# Altium project Kasli-SOC.PrjPcb (part 4 of 11)

## Sheet Kasli-SOC_bank13.SchDoc: Bank 13
size 420 x 297 mm; Projet: FPGA & ARM SoC FMC Carrier; CheckedBy: G.Kasprowicz; Author: F.Switakowski; CompanyName: WUT ISE; DrawnBy: F.Switakowski; Organization: WUT ISE; Address1: PW ISE; Address2: Nowowiejska 15/19 00-665 Warsaw; Address3: gkasprow@gmail.com; DocumentNumber: 8; Revision: 1; SheetNumber: 8; SheetTotal: 18; ModifiedBy: -; CheckedDate: -; Title2: misc signals; DivGrp: WUT ISE; Designer: G.Kasprowicz; ModifiedDate: -; ProjectName: Sensor Box
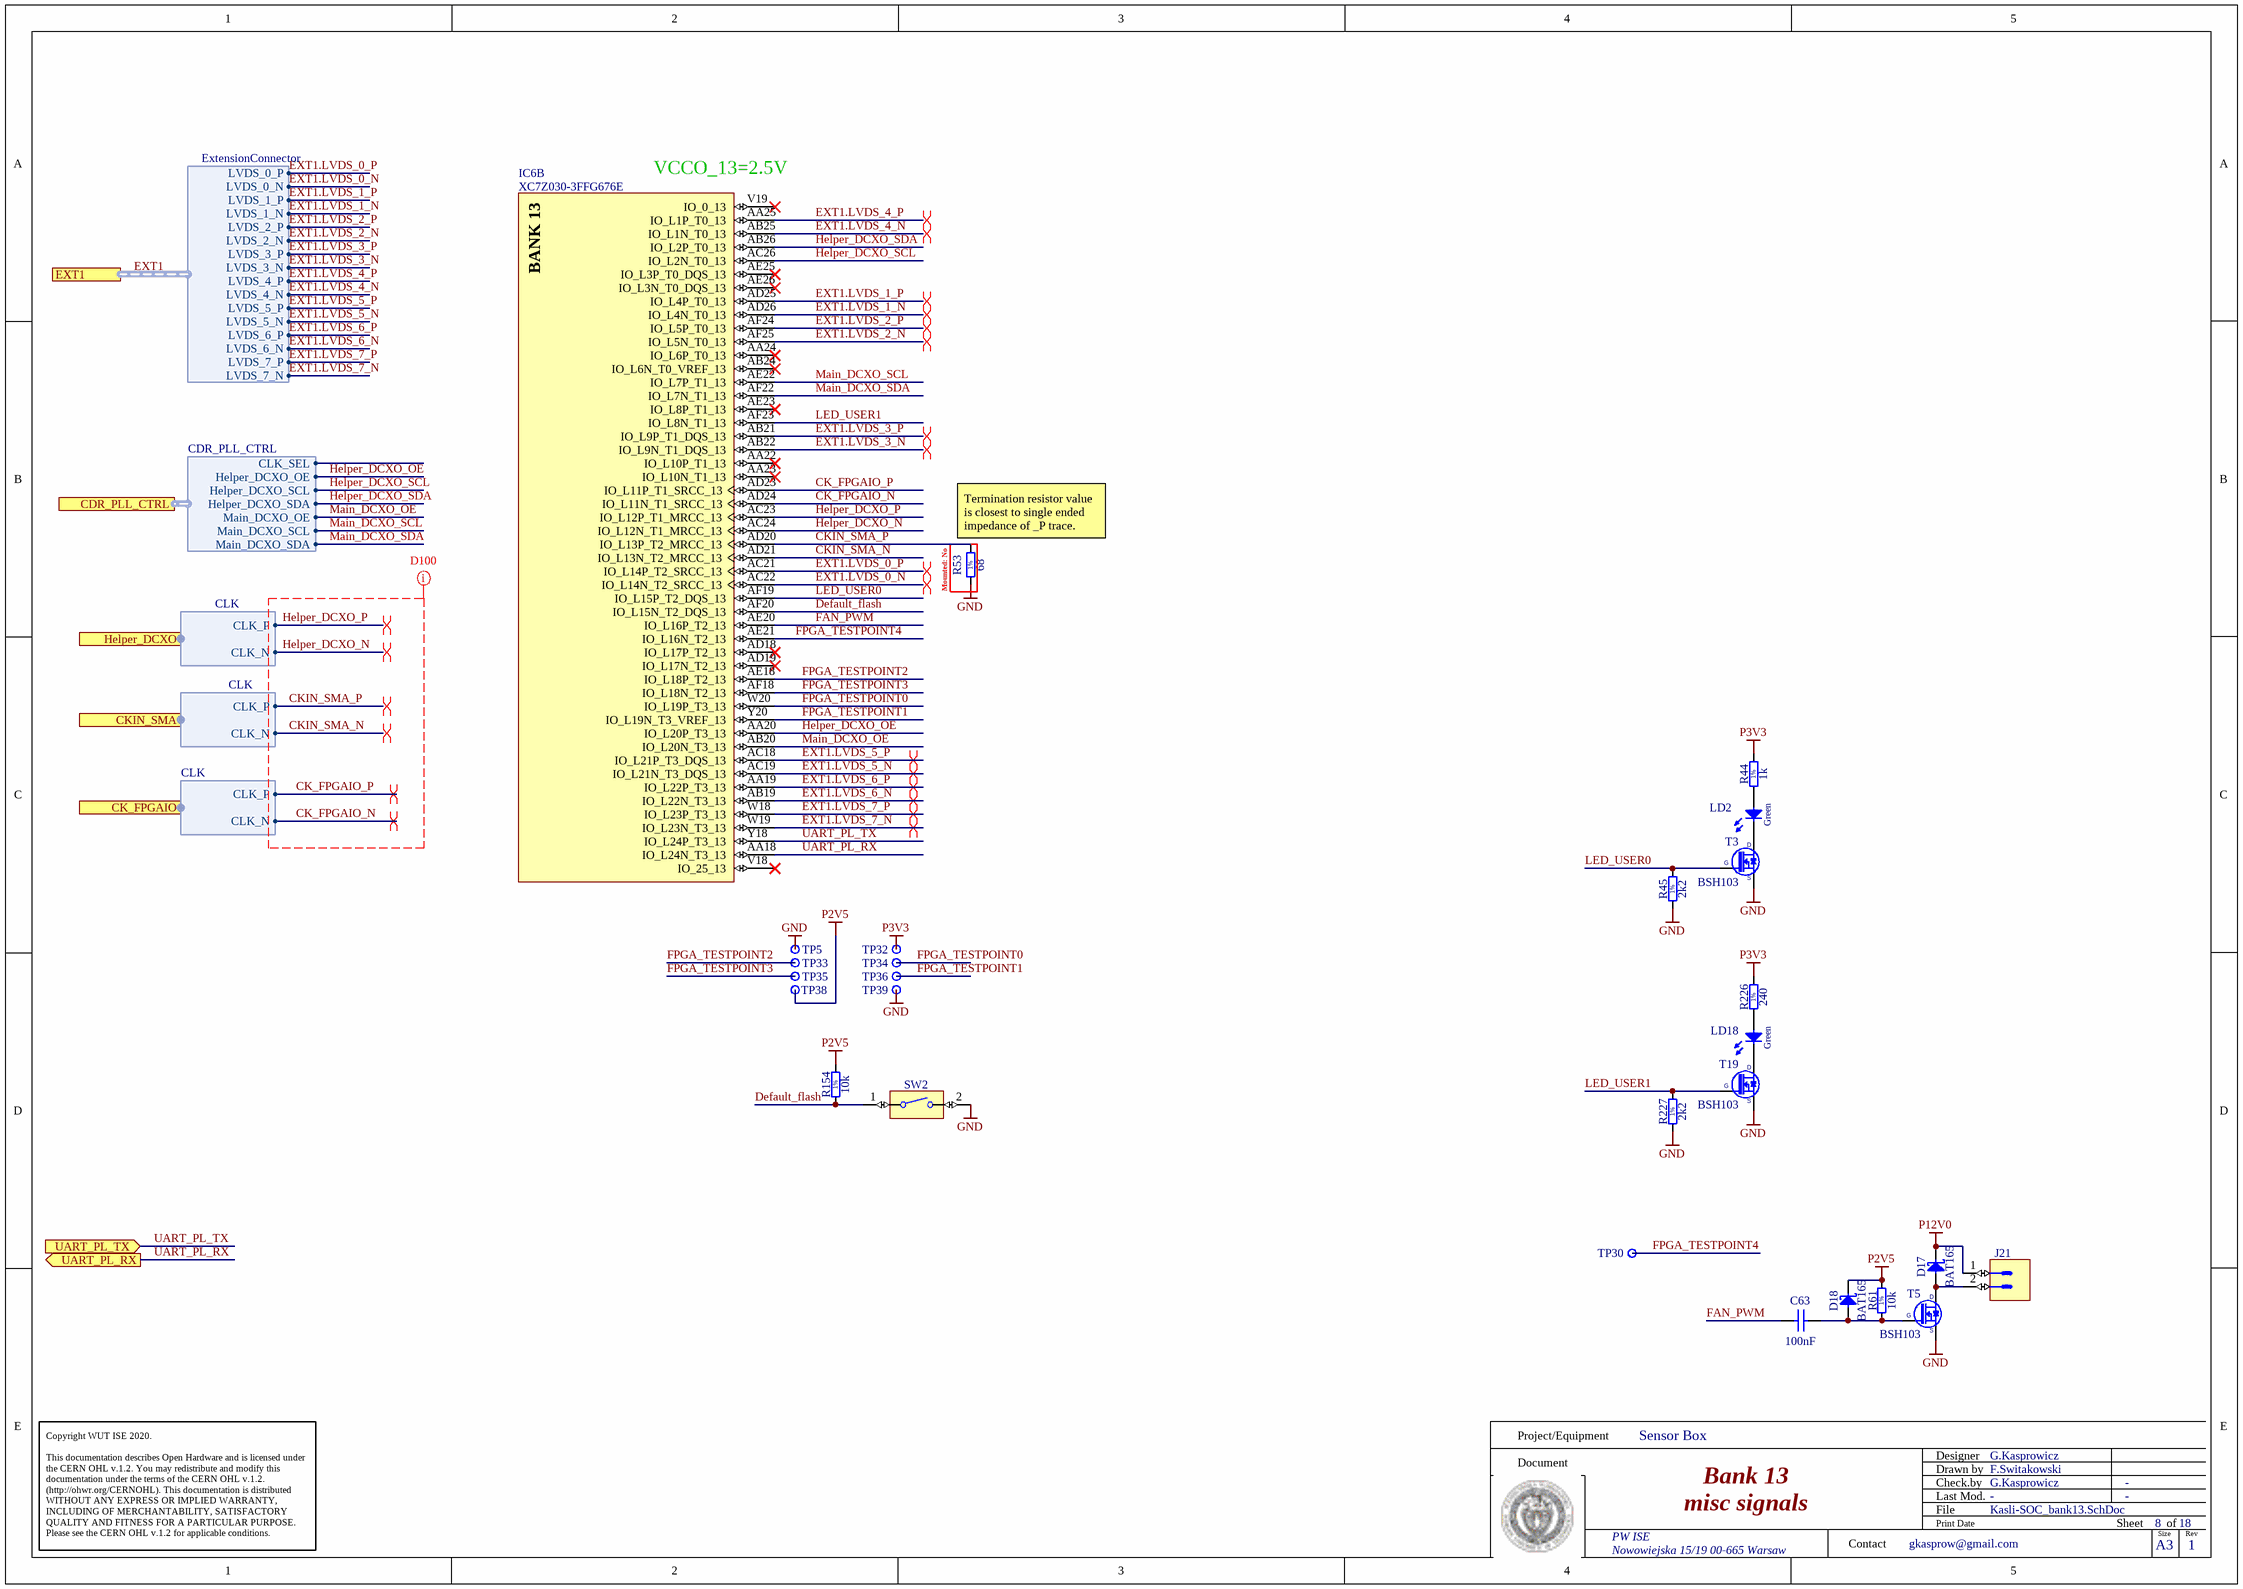
[diagram p7: Kasli-SOC_bank13.SchDoc]

### Parts
C63  100nF  [CAPC0603X33N]
D17  BAT165  [SOD2512X110N]
D18  BAT165  [SOD2512X110N]
IC6  XC7Z030-3FFG676E  [BGA676C100P26X26_2700X2700X324]  (part B of 14)
J21  KK®  [MOLEX_22-27-2021]  (value not drawn)
LD2  Green  [LED_KINGBRIGHT_KPH-1608CGCK]
LD18  Green  [LED_AVAGO_HSME-C120]
R44  1k  [RESC1005X40N]
R45  2k2  [RESC1005X40N]
R53  68  [RESC1005X40N]
R61  10k  [RESC1005X40N]
R154  10k  [RESC1005X40N]
R226  240  [RESC1005X40N]
R227  2k2  [RESC1005X40N]
SW2  Switch  [SW_OMRON_B3U-3000PM]  (value not drawn)
T3  BSH103  [SOT95P230X110-3N]
T5  BSH103  [SOT95P230X110-3N]
T19  BSH103  [SOT95P230X110-3N]
TP5  Plated Hole  [c170h100]  (value not drawn)  (no BOM)
TP30  Test Point  [TPS127]  (value not drawn)  (no BOM)
TP32  Plated Hole  [c170h100]  (value not drawn)  (no BOM)
TP33  Plated Hole  [c170h100]  (value not drawn)  (no BOM)
TP34  Plated Hole  [c170h100]  (value not drawn)  (no BOM)
TP35  Plated Hole  [c170h100]  (value not drawn)  (no BOM)
TP36  Plated Hole  [c170h100]  (value not drawn)  (no BOM)
TP38  Plated Hole  [c170h100]  (value not drawn)  (no BOM)
TP39  Plated Hole  [c170h100]  (value not drawn)  (no BOM)

### Ports
CDR_PLL_CTRL (harness CDR_PLL_CTRL), CK_FPGAIO (harness CLK), CKIN_SMA (harness CLK), EXT1 (harness ExtensionConnector), Helper_DCXO (harness CLK), UART_PL_RX (out), UART_PL_TX (in)

### Harnesses
CDR_PLL_CTRL: CLK_SEL, Helper_DCXO_OE, Helper_DCXO_SCL, Helper_DCXO_SDA, Main_DCXO_OE, Main_DCXO_SCL, Main_DCXO_SDA
ExtensionConnector: LVDS_0_N, LVDS_0_P, LVDS_1_N, LVDS_1_P, LVDS_2_N, LVDS_2_P, LVDS_3_N, LVDS_3_P, LVDS_4_N, LVDS_4_P, LVDS_5_N, LVDS_5_P, LVDS_6_N, LVDS_6_P, LVDS_7_N, LVDS_7_P
CLK: CLK_P, CLK_N

### Nets
GND: R45.1 R53.1 R227.1 SW2.2 T3.2(S) T5.2(S) T19.2(S) TP5.1 TP39.1
P2V5: D18.1(C) R61.2 R154.2 TP38.1
P3V3: R44.2 R226.2 TP32.1
P12V0: D17.1(C) J21.1
CK_FPGAIO_N: IC6.AD24(IO_L11N_T1_SRCC_13) ; port CK_FPGAIO.CLK_N
CK_FPGAIO_P: IC6.AD23(IO_L11P_T1_SRCC_13) ; port CK_FPGAIO.CLK_P
CKIN_SMA_N: IC6.AD21(IO_L13N_T2_MRCC_13) ; port CKIN_SMA.CLK_N
CKIN_SMA_P: IC6.AD20(IO_L13P_T2_MRCC_13) R53.2 ; port CKIN_SMA.CLK_P
Default_flash: IC6.AF20(IO_L15N_T2_DQS_13) R154.1 SW2.1
EXT1.LVDS_0_N: IC6.AC22(IO_L14N_T2_SRCC_13) ; port EXT1.LVDS_0_N
EXT1.LVDS_0_P: IC6.AC21(IO_L14P_T2_SRCC_13) ; port EXT1.LVDS_0_P
EXT1.LVDS_1_N: IC6.AD26(IO_L4N_T0_13) ; port EXT1.LVDS_1_N
EXT1.LVDS_1_P: IC6.AD25(IO_L4P_T0_13) ; port EXT1.LVDS_1_P
EXT1.LVDS_2_N: IC6.AF25(IO_L5N_T0_13) ; port EXT1.LVDS_2_N
EXT1.LVDS_2_P: IC6.AF24(IO_L5P_T0_13) ; port EXT1.LVDS_2_P
EXT1.LVDS_3_N: IC6.AB22(IO_L9N_T1_DQS_13) ; port EXT1.LVDS_3_N
EXT1.LVDS_3_P: IC6.AB21(IO_L9P_T1_DQS_13) ; port EXT1.LVDS_3_P
EXT1.LVDS_4_N: IC6.AB25(IO_L1N_T0_13) ; port EXT1.LVDS_4_N
EXT1.LVDS_4_P: IC6.AA25(IO_L1P_T0_13) ; port EXT1.LVDS_4_P
EXT1.LVDS_5_N: IC6.AC19(IO_L21N_T3_DQS_13) ; port EXT1.LVDS_5_N
EXT1.LVDS_5_P: IC6.AC18(IO_L21P_T3_DQS_13) ; port EXT1.LVDS_5_P
EXT1.LVDS_6_N: IC6.AB19(IO_L22N_T3_13) ; port EXT1.LVDS_6_N
EXT1.LVDS_6_P: IC6.AA19(IO_L22P_T3_13) ; port EXT1.LVDS_6_P
EXT1.LVDS_7_N: IC6.W19(IO_L23N_T3_13) ; port EXT1.LVDS_7_N
EXT1.LVDS_7_P: IC6.W18(IO_L23P_T3_13) ; port EXT1.LVDS_7_P
FAN_PWM: C63.2 IC6.AE20(IO_L16P_T2_13)
FPGA_TESTPOINT0: IC6.W20(IO_L19P_T3_13) TP34.1
FPGA_TESTPOINT1: IC6.Y20(IO_L19N_T3_VREF_13) TP36.1
FPGA_TESTPOINT2: IC6.AE18(IO_L18P_T2_13) TP33.1
FPGA_TESTPOINT3: IC6.AF18(IO_L18N_T2_13) TP35.1
FPGA_TESTPOINT4: IC6.AE21(IO_L16N_T2_13) TP30.1
Helper_DCXO_N: IC6.AC24(IO_L12N_T1_MRCC_13) ; port Helper_DCXO.CLK_N
Helper_DCXO_OE: IC6.AA20(IO_L20P_T3_13) ; port CDR_PLL_CTRL.Helper_DCXO_OE
Helper_DCXO_P: IC6.AC23(IO_L12P_T1_MRCC_13) ; port Helper_DCXO.CLK_P
Helper_DCXO_SCL: IC6.AC26(IO_L2N_T0_13) ; port CDR_PLL_CTRL.Helper_DCXO_SCL
Helper_DCXO_SDA: IC6.AB26(IO_L2P_T0_13) ; port CDR_PLL_CTRL.Helper_DCXO_SDA
LED_USER0: IC6.AF19(IO_L15P_T2_DQS_13) R45.2 T3.1(G)
LED_USER1: IC6.AF23(IO_L8N_T1_13) R227.2 T19.1(G)
Main_DCXO_OE: IC6.AB20(IO_L20N_T3_13) ; port CDR_PLL_CTRL.Main_DCXO_OE
Main_DCXO_SCL: IC6.AE22(IO_L7P_T1_13) ; port CDR_PLL_CTRL.Main_DCXO_SCL
Main_DCXO_SDA: IC6.AF22(IO_L7N_T1_13) ; port CDR_PLL_CTRL.Main_DCXO_SDA
UART_PL_RX: IC6.AA18(IO_L24N_T3_13) ; port UART_PL_RX
UART_PL_TX: IC6.Y18(IO_L24P_T3_13) ; port UART_PL_TX
NetC63_1: C63.1 D18.2(A) R61.1 T5.1(G)
NetD17_2: D17.2(A) J21.2 T5.3(D)
NetLD2_1: LD2.1(C) T3.3(D)
NetLD2_2: LD2.2(A) R44.1
NetLD18_1: LD18.1(C) T19.3(D)
NetLD18_2: LD18.2(A) R226.1

Not connected (* = marked no-connect by the designer): IC6 AA22(IO_L10P_T1_13)* AA23(IO_L10N_T1_13)* AA24(IO_L6P_T0_13)* AB24(IO_L6N_T0_VREF_13)* AD18(IO_L17P_T2_13)* AD19(IO_L17N_T2_13)* AE23(IO_L8P_T1_13)* AE25(IO_L3P_T0_DQS_13)* AE26(IO_L3N_T0_DQS_13)* V18(IO_25_13)* V19(IO_0_13)*

### Buses and harness runs
harness EXT1 = port EXT1

### Layout directives
differential pair; differential pair class LVPECL: CK_FPGAIO_N, CK_FPGAIO_P
differential pair; differential pair class Diff_100Ohm: CKIN_SMA_N, CKIN_SMA_P, Helper_DCXO_N, Helper_DCXO_P
differential pair: EXT1.LVDS_0_N, EXT1.LVDS_0_P, EXT1.LVDS_1_N, EXT1.LVDS_1_P, EXT1.LVDS_2_N, EXT1.LVDS_2_P, EXT1.LVDS_3_N, EXT1.LVDS_3_P, EXT1.LVDS_4_N, EXT1.LVDS_4_P, EXT1.LVDS_5_N, EXT1.LVDS_5_P, EXT1.LVDS_6_N, EXT1.LVDS_6_P, EXT1.LVDS_7_N, EXT1.LVDS_7_P
net class D100: CK_FPGAIO_N, CK_FPGAIO_P, CKIN_SMA_N, CKIN_SMA_P, Helper_DCXO_N, Helper_DCXO_P

### Notes on the sheet
- (near IC6) VCCO_13=2.5V
- (near R53) Termination resistor value is closest to single ended impedance of _P trace.
- (near R53) Mounted: No
- Project/Equipment
- Document
- Designer
- Drawn by
- Check.by
- Copyright WUT ISE 2020.
  This documentation describes Open Hardware and is licensed under the CERN OHL v.1.2. You may redistribute and modify this documentation under the terms of the CERN OHL v.1.2. (http://ohwr.org/CERNOHL). This documentation is distributed WITHOUT ANY EXPRESS OR IMPLIED WARRANTY, INCLUDING OF MERCHANTABILITY, SATISFACTORY QUALITY AND FITNESS FOR A PARTICULAR PURPOSE. Please see the CERN OHL v.1.2 for applicable conditions.
- Contact
- File
- Last Mod.
- Print Date
- Sheet
- Size
- A3
- of
- Rev
- (in symbol R0402_1k_1%_0.0625W_100PPM) 1%
- (in symbol R0402_2K2_1%_0.0625W_100PPM) 1%
- (in symbol R0402_10k_1%_0.0625W_100PPM) 1%
- (in symbol R0402_68R_1%_0.0625W_100PPM) 1%
- (in symbol R0402_240R_1%_0.0625W_100PPM) 1%
- (in symbol XC7Z030-2FFG676I, part B) BANK 13

### Library data of the parts
C63 = CC0201_100NF_6.3V_10%_X5R: as C50 on sheet Kasli-SOC_bank500-501; Part Number: CC0201_100NF_6.3V_10%_X5R; Component Kind: Standard; Component Type: Standard; Pin Count: 2; Value: 100nF; Status: Not Recommended; Manufacturer Part Number: CC0201_100NF_6.3V_10%_X5R; Case: 0201; Mounted: Yes; Socket: No; SMD: Yes; Sense: No; Manufacturer1 Example: AVX; Manufacturer1 ComponentHeight: 0.33mm; HelpURL: \\cern.ch\dfs\Applications\Altium\Datasheets\CC0201_X5R_AVX.pdf; Author: CERN DEM JLC; CreateDate: 2007-12-03; LatestRevisionDate: 2007-12-03; ClassName: FPGA_JTAG
D17 D18 = BAT165: Schottky Diode; Part Description: Medium Power AF Schottky Diode; Manufacturer: INFINEON; Voltage: 40V; Power: 750mA; PressFit: No; Bonding: No; Part Number: BAT165; Component Kind: Standard; Component Type: Standard; Device: BAT165; PackageDescription: Small Outline Diode (SOD-323), 1.70mm W X 1.25mm L X 1.10mm H body,  IPC Medium Density; Manufacturer Part Number: BAT165; Pin Count: 2; Case: SOD323; Mounted: Yes; Socket: No; SMD: Yes; Sense: No; ComponentHeight: 1.1mm; HelpURL: \\cern.ch\dfs\Applications\Altium\Datasheets\BAT165.pdf; Author: CERN DEM JLC; CreateDate: 12.11.2014; LatestRevisionDate: 12.11.2014
IC6 = XC7Z030-2FFG676I: 733 MHz Zynq™-7000 AP SoC, 130 PS I/O, 254 FPGA I/O, 676-Ball BGA, Speed Grade 2, Industrial Grade, Pb-Free; Part Description: Zynq™-7000 All Programmable SoC, Dual-core ARM® Cortex™-A9 CPU, 676-Ball BGA, Speed Grade 2, Industrial Grade, Pb-Free; Manufacturer: XILINX; PressFit: No; Bonding: No; Part Number: XC7Z030-3FFG676E; Component Kind: Standard; Component Type: Standard; Device: XC7Z030-2FFG676I; PackageDescription: BGA, 1.00mm Pitch, Square; 676 Pin, 26 Columns X 26 Rows, 27.00mm X 27.00mm X 2.60mm H; Manufacturer Part Number: XC7Z030-3FFG676E; Pin Count: 676; Case: BGA676; Mounted: Yes; Socket: No; SMD: Yes; Sense: No; ComponentHeight: 3.24mm; HelpURL: \\cern.ch\dfs\Applications\Altium\Datasheets\XC7Z030-2FFG676I.pdf; ComponentLink1URL: \\cern.ch\dfs\Applications\Altium\Datasheets\XC7Z030-2FFG676I_Package.pdf; ComponentLink1Description: Package; ComponentLink2URL: \\cern.ch\dfs\Applications\Altium\Datasheets\XC7Z030-2FFG676I_Pinout.txt; ComponentLink2Description: Pinout; Author: CERN DEM JLC; CreateDate: 29/04/2014; LatestRevisionDate: 29/04/2014
J21 = MOLEX_22-27-2021: Connector 2 Male; Part Description: 2.54mm (.100") Pitch KK® Wire-to-Board Header, Vertical, with Friction Lock, 2 Circuits, Tin (Sn) Plating; Manufacturer: MOLEX; PressFit: No; Part Number: MOLEX_22-27-2021; Component Kind: Standard; Component Type: Standard; Pin Count: 2; Family: KK®; Mounted: Yes; Socket: No; SMD: No; Sense: No; Status: None; Manufacturer Part Number: 22-27-2021; ComponentHeight: 11.7mm; HelpURL: \\cern.ch\dfs\Applications\Altium\Datasheets\MOLEX_22-27-2021.pdf; Author: CERN DEM JLC; CreateDate: 04.12.2008; LatestRevisionDate: 04.12.2008
LD2 = LED_KINGBRIGHT_KPH-1608CGCK: LED Green 1C 2A; Part Description: SMD Green LED, Case 1.6mmX0.8mm(0603), 0.65mm Thickness; PressFit: No; Bonding: No; Manufacturer Part Number: KPH-1608CGCK; ComponentHeight: 0.65mm; HelpURL: \\cern.ch\dfs\Applications\Altium\Datasheets\LED_KINGBRIGHT_KPH-1608CGCK.pdf; Part Number: LED_KINGBRIGHT_KPH-1608CGCK; Component Kind: Standard; Component Type: Standard; Color: Green; PackageDescription: SMT Green LED, Case 0603, Body L 1.6 x W 0.8mm H 0.65mm; Manufacturer: KINGBRIGHT; Pin Count: 2; Mounted: Yes; Socket: No; SMD: Yes; Sense: No; Author: CERN DEM JLC; CreateDate: 03.07.2017; LatestRevisionDate: 03.07.2017
LD18 = LED_AVAGO_HSME-C120: LED Green 1C 2A; Part Description: High Performance Right Angle Chip Green LED; Manufacturer: AVAGO TECHNOLOGIES; PressFit: No; Bonding: No; Manufacturer Part Number: HSME-C120; ComponentHeight: 0.7mm; HelpURL: \\cern.ch\dfs\Applications\Altium\Datasheets\LED_AVAGO_HSME-C120.pdf; Part Number: LED_AVAGO_HSME-C120; Component Kind: Standard; Component Type: Standard; Color: Green; PackageDescription: Green Chip LED, 2-Leads, Body 1.7x1.1mm, Side Emitting Package; Pin Count: 2; Mounted: Yes; Socket: No; SMD: Yes; Sense: No; Author: CERN DEM JMW; CreateDate: 22.07.2009; LatestRevisionDate: 20.06.2012; ComponentLink1URL: \\cern.ch\dfs\Applications\Altium\Datasheets\LED_AVAGO_HSME-C110_DESIGN-GUIDE.pdf; ComponentLink1Description: Design Guide
R44 = R0402_1k_1%_0.0625W_100PPM: Resistor - 1%; Part Description: General Purpose Thick Film Chip Resistor; Manufacturer: GENERIC; Manufacturer1 Part Number: 232270671002L; TC: ±100ppm/°C; PressFit: No; Part Number: R0402_1K_1%_0.0625W_100PPM; Component Kind: Standard; Component Type: Standard; Pin Count: 2; Value: 1k; Status: Not Recommended; Power: 0.0625W; Tolerance: ±1%; Manufacturer Part Number: R0402_1K_1%_0.0625W_100PPM; Case: 0402; Mounted: Yes; Sense: No; Socket: No; SMD: Yes; Manufacturer1 Example: YAGEO PHYCOMP; Manufacturer1 ComponentHeight: 0.4mm; HelpURL: \\cern.ch\dfs\Applications\Altium\Datasheets\R0402_Phycomp_RC0402.pdf; Author: CERN DEM JLC; CreateDate: 03.12.2007; LatestRevisionDate: 17.10.2012; ClassName: Artix
R45 R227 = R0402_2K2_1%_0.0625W_100PPM: Resistor - 1%; Part Description: General Purpose Thick Film Chip Resistor; Manufacturer: GENERIC; Manufacturer1 Part Number: 232270672202L; TC: ±100ppm/°C; PressFit: No; Part Number: R0402_2K2_1%_0.0625W_100PPM; Component Kind: Standard; Component Type: Standard; Pin Count: 2; Value: 2k2; Status: Not Recommended; Power: 0.0625W; Tolerance: ±1%; Manufacturer Part Number: R0402_2K2_1%_0.0625W_100PPM; Case: 0402; Mounted: Yes; Sense: No; Socket: No; SMD: Yes; Manufacturer1 Example: YAGEO PHYCOMP; Manufacturer1 ComponentHeight: 0.4mm; HelpURL: \\cern.ch\dfs\Applications\Altium\Datasheets\R0402_Phycomp_RC0402.pdf; Author: CERN DEM JLC; CreateDate: 03.12.2007; LatestRevisionDate: 17.10.2012; ClassName: Artix
R53 = R0402_68R_1%_0.0625W_100PPM: Resistor - 1%; Part Description: General Purpose Thick Film Chip Resistor; Manufacturer: GENERIC; Manufacturer1 Part Number: 232270676809L; TC: ±100ppm/°C; PressFit: No; Part Number: R0402_68R_1%_0.0625W_100PPM; Component Kind: Standard; Component Type: Standard; Pin Count: 2; Value: 68; Status: Not Recommended; Power: 0.0625W; Tolerance: ±1%; Manufacturer Part Number: R0402_68R_1%_0.0625W_100PPM; Case: 0402; Mounted: Yes; Sense: No; Socket: No; SMD: Yes; Manufacturer1 Example: YAGEO PHYCOMP; Manufacturer1 ComponentHeight: 0.4mm; HelpURL: \\cern.ch\dfs\Applications\Altium\Datasheets\R0402_Phycomp_RC0402.pdf; Author: CERN DEM JLC; CreateDate: 03.12.2007; LatestRevisionDate: 17.10.2012
R61 R154 = R0402_10k_1%_0.0625W_100PPM: Resistor - 1%; Part Description: General Purpose Thick Film Chip Resistor; Manufacturer: GENERIC; Manufacturer1 Part Number: 232270671003L; TC: ±100ppm/°C; PressFit: No; Part Number: R0402_10K_1%_0.0625W_100PPM; Component Kind: Standard; Component Type: Standard; Pin Count: 2; Value: 10k; Status: Not Recommended; Power: 0.0625W; Tolerance: ±1%; Manufacturer Part Number: R0402_10K_1%_0.0625W_100PPM; Case: 0402; Mounted: Yes; Sense: No; Socket: No; SMD: Yes; Manufacturer1 Example: YAGEO PHYCOMP; Manufacturer1 ComponentHeight: 0.4mm; HelpURL: \\cern.ch\dfs\Applications\Altium\Datasheets\R0402_Phycomp_RC0402.pdf; Author: CERN DEM JLC; CreateDate: 03.12.2007; LatestRevisionDate: 17.10.2012
R226 = R0402_240R_1%_0.0625W_100PPM: Resistor - 1%; Part Description: General Purpose Thick Film Chip Resistor; Manufacturer: GENERIC; Manufacturer1 Part Number: 232270672401L; TC: ±100ppm/°C; PressFit: No; Part Number: R0402_240R_1%_0.0625W_100PPM; Component Kind: Standard; Component Type: Standard; Pin Count: 2; Value: 240; Status: Not Recommended; Power: 0.0625W; Tolerance: ±1%; Manufacturer Part Number: R0402_240R_1%_0.0625W_100PPM; Case: 0402; Mounted: Yes; Sense: No; Socket: No; SMD: Yes; Manufacturer1 Example: YAGEO PHYCOMP; Manufacturer1 ComponentHeight: 0.4mm; HelpURL: \\cern.ch\dfs\Applications\Altium\Datasheets\R0402_Phycomp_RC0402.pdf; Author: CERN DEM JLC; CreateDate: 03.12.2007; LatestRevisionDate: 17.10.2012
SW2 = SW_OMRON_B3U-3000PM: 1 Ways SPST DIP Switch; Part Description: Ultra-small Surface-mounting Tactile Switche with High Contact Reliability, Side-actuated, Contact Rating 50mA 12VDC; Manufacturer: OMRON; PressFit: No; Sense Comment: Non-washable; Part Number: SW_OMRON_B3U-3000PM; Component Kind: Standard; Component Type: Standard; Pin Count: 2; PackageDescription: Body 3.2x4.0mm, SPST Surface-Mounting Tactile Switch with Side Actuator (B3U Series); Family: Switch; Mounted: Yes; Socket: No; SMD: Yes; Sense: Yes; Status: None; Manufacturer Part Number: B3U-3000PM; ComponentHeight: 1.35mm; HelpURL: \\cern.ch\dfs\Applications\Altium\Datasheets\SW_OMRON_B3U.pdf; Author: CERN DEM HF; CreateDate: 04.10.2022; LatestRevisionDate: 04.10.2022
T3 T5 T19 = BSH103: N-CHANNEL MOSFET WITH DIODE; Part Description: 30V 850mA N-Channel Enhancement Mode Field-Effect Transistor; Manufacturer: NEXPERIA; PressFit: No; Bonding: No; Part Number: BSH103; Component Kind: Standard; Component Type: Standard; Device: BSH103; PackageDescription: SOT23, 3 pin, Pitch 0.95mm - 1.3mm W X 2.9mm L X 1.1mm H, IPC Medium Density; Manufacturer Part Number: BSH103; Pin Count: 3; Case: SOT23-3; Mounted: Yes; Socket: No; SMD: Yes; Sense: No; ComponentHeight: 1.1mm; HelpURL: \\cern.ch\dfs\Applications\Altium\Datasheets\BSH103.pdf; Author: CERN DEM JLC; CreateDate: 16.03.2010; LatestRevisionDate: 20.06.2017; ClassName: Artix
TP5 TP32-TP36 TP38 TP39 = PLATED_HOLE1.0_PAD1.7: Single Terminal Socket; Part Description: Plated Through Hole: Hole Dia.=1.0mm Pad Dia.=1.7mm,  IPC-7251 Level A; Mounted: No; Part Number: PLATED_HOLE1.0_PAD1.7; Component Type: Standard (No BOM); Pin Count: 1; Family: Plated Hole; Socket: No; SMD: No; Sense: No; Status: None; ComponentHeight: 0mm; HelpURL: Undefined; Author: CERN DEM JLC; CreateDate: 11.05.2017; LatestRevisionDate: 11.05.2017; PackageDescription: Plated Through Hole: Hole Dia.=1.0mm Pad Dia.=1.7mm,  IPC-7251 Level A
TP30 = SMD_PAD_1.27X1.27MM: Part Description: 1.27mm x 1.27mm PCB Copper Area (SMD Test Point); Mounted: No; Part Number: SMD_PAD_1.27X1.27MM; Component Type: Standard (No BOM); Pin Count: 1; Family: Test Point; Socket: No; SMD: No; Sense: No; Status: None; ComponentHeight: 0mm; HelpURL: Undefined; Author: CERN DEM JLC; CreateDate: 12.01.2008; LatestRevisionDate: 12.01.2008; PackageDescription: 1.27mm x 1.27mm PCB Copper Area (SMD Test Point)

## Sheet Kasli-SOC_IDC_EXT_Connectors.SchDoc: EEM Connectors
size 420 x 297 mm; EDA_Number: ARTIQ; Projet: ARTIQ/SINARA; CheckedBy: G.Kasprowicz; Author: F.Switakowski; CompanyName: WUT ISE; DrawnBy: F.Switakowski; Organization: WUT ISE; Address1: PW ISE; Address2: Nowowiejska 15/19 00-665 Warsaw; Address3: gkasprow@gmail.com; DocumentNumber: 9; Revision: 1; SheetNumber: 9; SheetTotal: 18; ModifiedBy: -; CheckedDate: -; Title2: & I2C protection; DivGrp: WUT ISE; Designer: G.Kasprowicz; ModifiedDate: -; ProjectName: Sensor Box
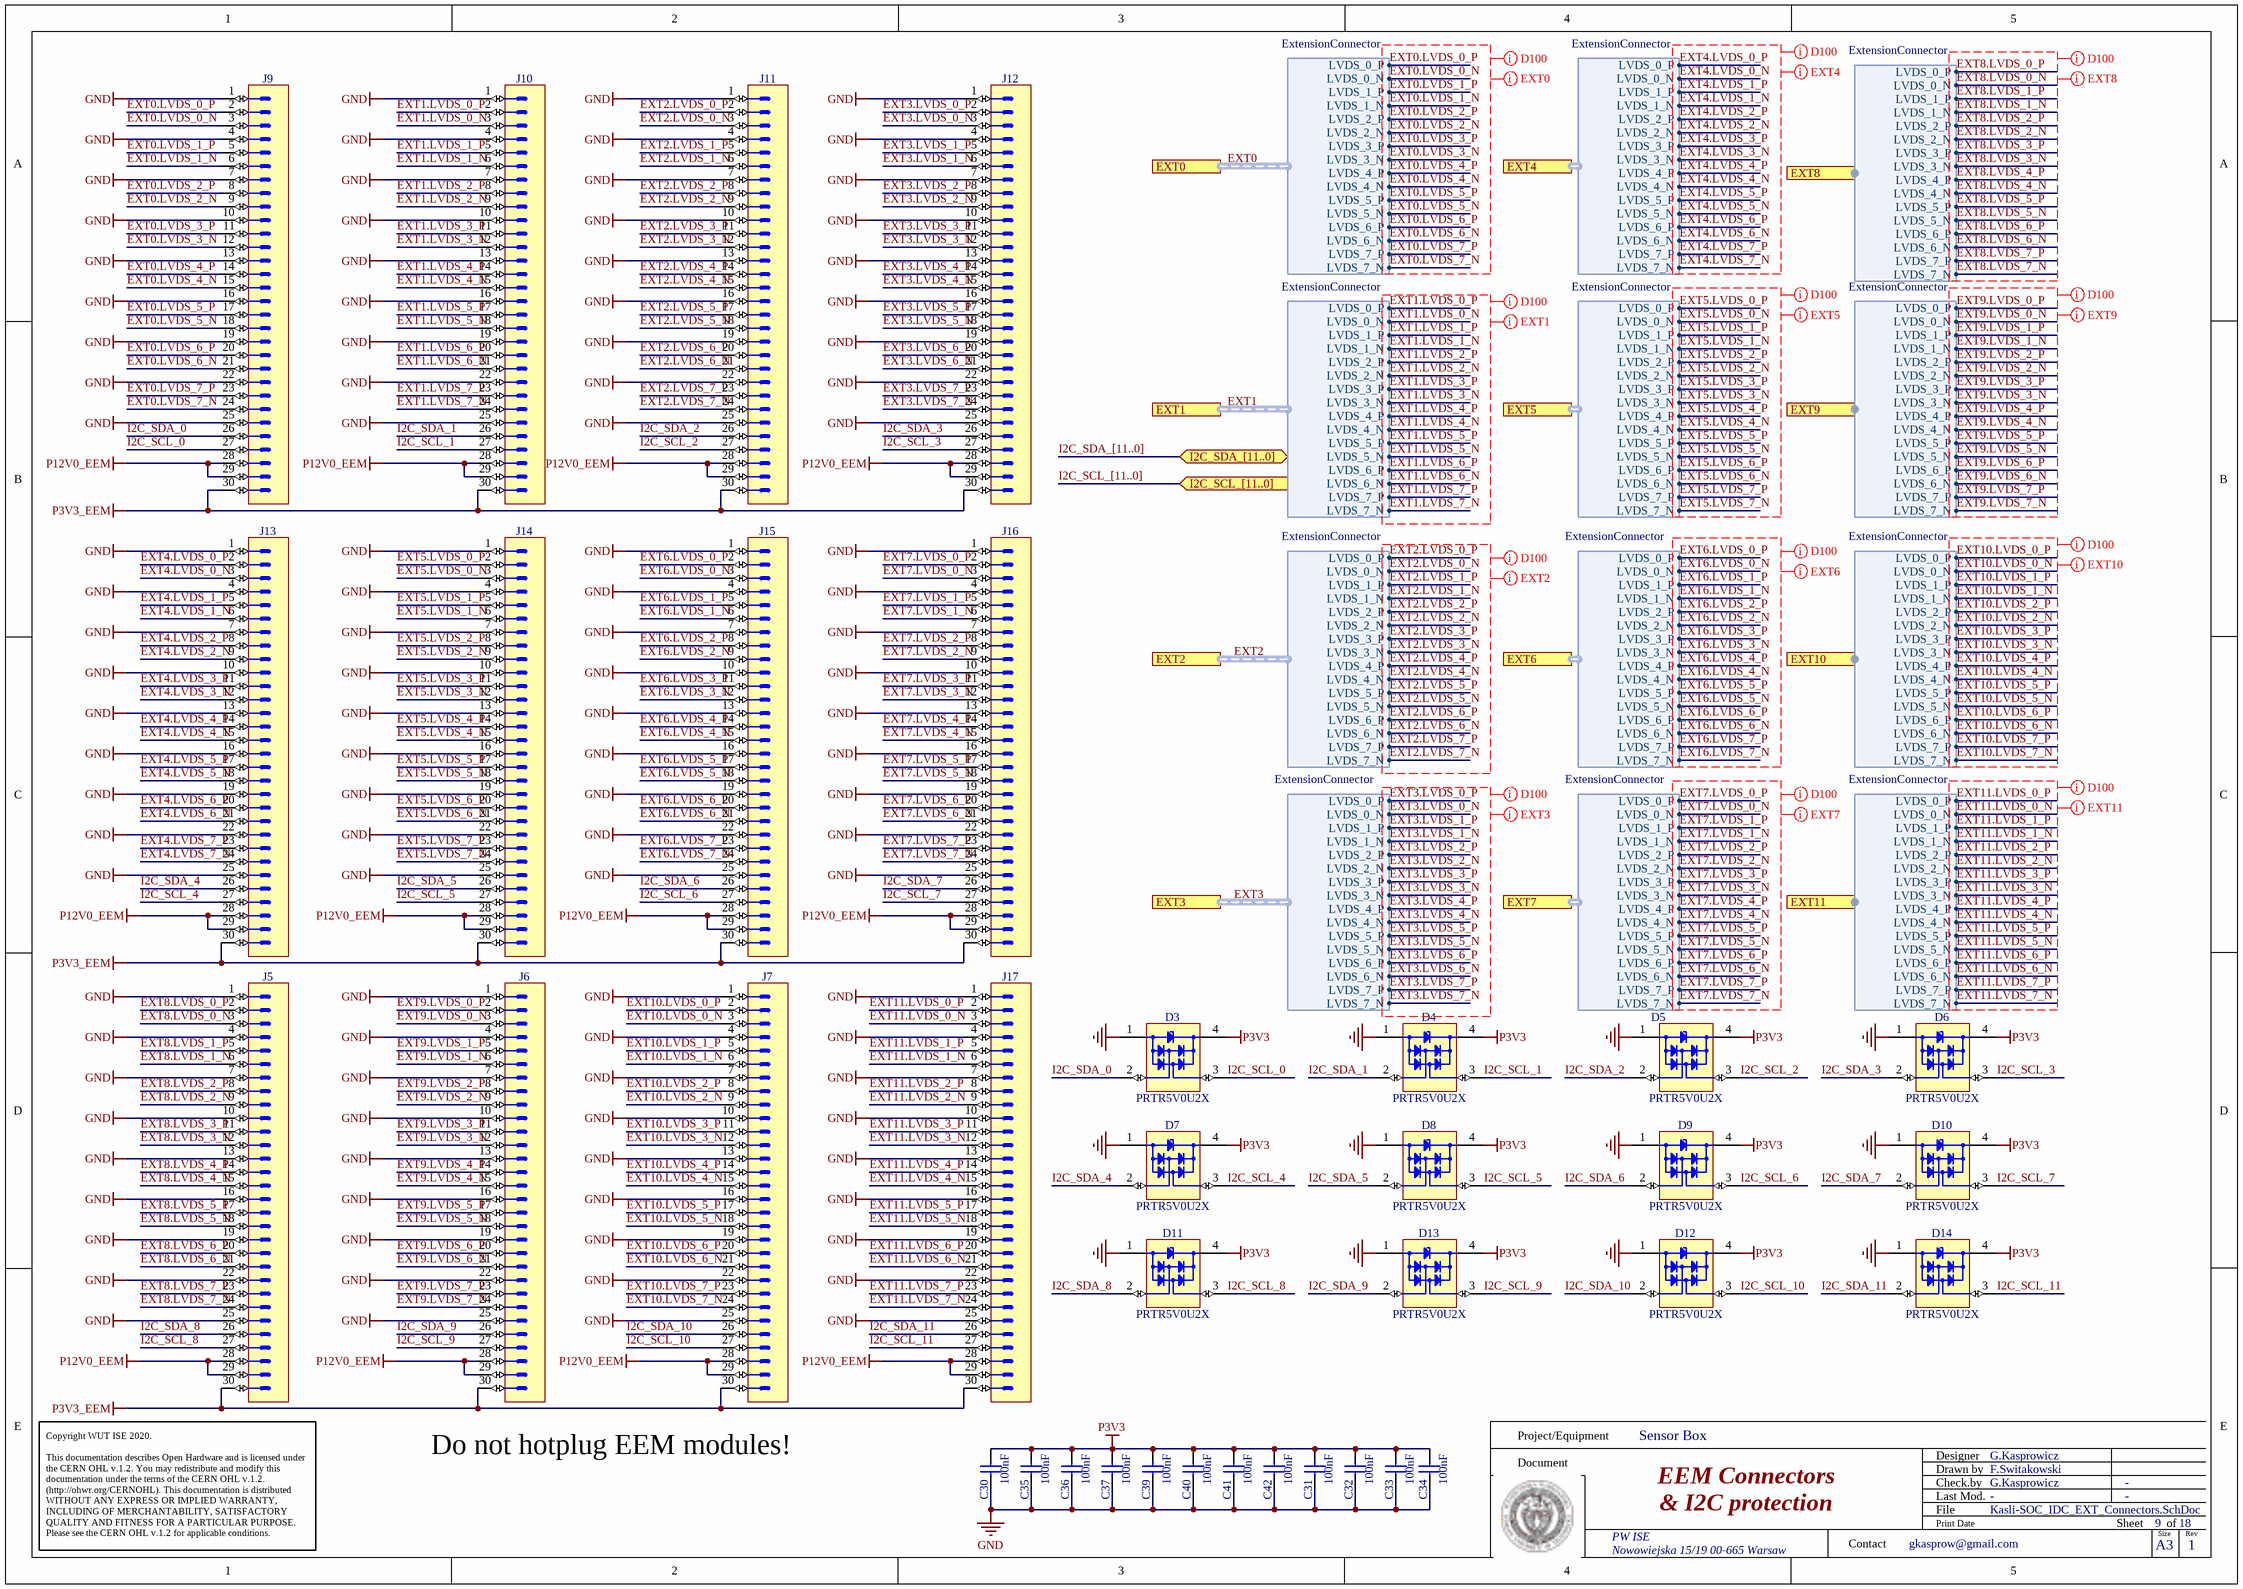
[diagram p8: Kasli-SOC_IDC_EXT_Connectors.SchDoc]

### Parts
C30  100nF  [CAPC0603X33N]
C31  100nF  [CAPC0603X33N]
C32  100nF  [CAPC0603X33N]
C33  100nF  [CAPC0603X33N]
C34  100nF  [CAPC0603X33N]
C35  100nF  [CAPC0603X33N]
C36  100nF  [CAPC0603X33N]
C37  100nF  [CAPC0603X33N]
C39  100nF  [CAPC0603X33N]
C40  100nF  [CAPC0603X33N]
C41  100nF  [CAPC0603X33N]
C42  100nF  [CAPC0603X33N]
D3  PRTR5V0U2X  [SOT190P230X110-4N]
D4  PRTR5V0U2X  [SOT190P230X110-4N]
D5  PRTR5V0U2X  [SOT190P230X110-4N]
D6  PRTR5V0U2X  [SOT190P230X110-4N]
D7  PRTR5V0U2X  [SOT190P230X110-4N]
D8  PRTR5V0U2X  [SOT190P230X110-4N]
D9  PRTR5V0U2X  [SOT190P230X110-4N]
D10  PRTR5V0U2X  [SOT190P230X110-4N]
D11  PRTR5V0U2X  [SOT190P230X110-4N]
D12  PRTR5V0U2X  [SOT190P230X110-4N]
D13  PRTR5V0U2X  [SOT190P230X110-4N]
D14  PRTR5V0U2X  [SOT190P230X110-4N]
J5  (no value)  [3M_N2530-6002RB]
J6  (no value)  [3M_N2530-6002RB]
J7  (no value)  [3M_N2530-6002RB]
J9  (no value)  [3M_N2530-6002RB]
J10  (no value)  [3M_N2530-6002RB]
J11  (no value)  [3M_N2530-6002RB]
J12  (no value)  [3M_N2530-6002RB]
J13  (no value)  [3M_N2530-6002RB]
J14  (no value)  [3M_N2530-6002RB]
J15  (no value)  [3M_N2530-6002RB]
J16  (no value)  [3M_N2530-6002RB]
J17  (no value)  [3M_N2530-6002RB]

### Ports
EXT0 (harness ExtensionConnector), EXT1 (harness ExtensionConnector), EXT2 (harness ExtensionConnector), EXT3 (harness ExtensionConnector), EXT4 (harness ExtensionConnector), EXT5 (harness ExtensionConnector), EXT6 (harness ExtensionConnector), EXT7 (harness ExtensionConnector), EXT8 (harness ExtensionConnector), EXT9 (harness ExtensionConnector), EXT10 (harness ExtensionConnector), EXT11 (harness ExtensionConnector), I2C_SCL_[11..0] (in), I2C_SDA_[11..0] (bidir)

### Harnesses
ExtensionConnector: LVDS_0_N, LVDS_0_P, LVDS_1_N, LVDS_1_P, LVDS_2_N, LVDS_2_P, LVDS_3_N, LVDS_3_P, LVDS_4_N, LVDS_4_P, LVDS_5_N, LVDS_5_P, LVDS_6_N, LVDS_6_P, LVDS_7_N, LVDS_7_P

### Nets
GND: C30.1 C31.1 C32.1 C33.1 C34.1 C35.1 C36.1 C37.1 C39.1 C40.1 C41.1 C42.1 D3.1(GND) D4.1(GND) D5.1(GND) D6.1(GND) D7.1(GND) D8.1(GND) D9.1(GND) D10.1(GND) D11.1(GND) D12.1(GND) D13.1(GND) D14.1(GND) J5.1 J5.4 J5.7 J5.10 J5.13 J5.16 J5.19 J5.22 J5.25 J6.1 J6.4 J6.7 J6.10 J6.13 J6.16 J6.19 J6.22 J6.25 J7.1 J7.4 J7.7 J7.10 J7.13 J7.16 J7.19 J7.22 J7.25 J9.1 J9.4 J9.7 J9.10 J9.13 J9.16 J9.19 J9.22 J9.25 J10.1 J10.4 J10.7 J10.10 J10.13 J10.16 J10.19 J10.22 J10.25 J11.1 J11.4 J11.7 J11.10 J11.13 J11.16 J11.19 J11.22 J11.25 J12.1 J12.4 J12.7 J12.10 J12.13 J12.16 J12.19 J12.22 J12.25 J13.1 J13.4 J13.7 J13.10 J13.13 J13.16 J13.19 J13.22 J13.25 J14.1 J14.4 J14.7 J14.10 J14.13 J14.16 J14.19 J14.22 J14.25 J15.1 J15.4 J15.7 J15.10 J15.13 J15.16 J15.19 J15.22 J15.25 J16.1 J16.4 J16.7 J16.10 J16.13 J16.16 J16.19 J16.22 J16.25 J17.1 J17.4 J17.7 J17.10 J17.13 J17.16 J17.19 J17.22 J17.25
P3V3: C30.2 C31.2 C32.2 C33.2 C34.2 C35.2 C36.2 C37.2 C39.2 C40.2 C41.2 C42.2 D3.4(VCC) D4.4(VCC) D5.4(VCC) D6.4(VCC) D7.4(VCC) D8.4(VCC) D9.4(VCC) D10.4(VCC) D11.4(VCC) D12.4(VCC) D13.4(VCC) D14.4(VCC)
P3V3_EEM: J5.30 J6.30 J7.30 J9.30 J10.30 J11.30 J12.30 J13.30 J14.30 J15.30 J16.30 J17.30
P12V0_EEM: J5.28 J5.29 J6.28 J6.29 J7.28 J7.29 J9.28 J9.29 J10.28 J10.29 J11.28 J11.29 J12.28 J12.29 J13.28 J13.29 J14.28 J14.29 J15.28 J15.29 J16.28 J16.29 J17.28 J17.29
EXT0.LVDS_0_N: J9.3 ; port EXT0.LVDS_0_N
EXT0.LVDS_0_P: J9.2 ; port EXT0.LVDS_0_P
EXT0.LVDS_1_N: J9.6 ; port EXT0.LVDS_1_N
EXT0.LVDS_1_P: J9.5 ; port EXT0.LVDS_1_P
EXT0.LVDS_2_N: J9.9 ; port EXT0.LVDS_2_N
EXT0.LVDS_2_P: J9.8 ; port EXT0.LVDS_2_P
EXT0.LVDS_3_N: J9.12 ; port EXT0.LVDS_3_N
EXT0.LVDS_3_P: J9.11 ; port EXT0.LVDS_3_P
EXT0.LVDS_4_N: J9.15 ; port EXT0.LVDS_4_N
EXT0.LVDS_4_P: J9.14 ; port EXT0.LVDS_4_P
EXT0.LVDS_5_N: J9.18 ; port EXT0.LVDS_5_N
EXT0.LVDS_5_P: J9.17 ; port EXT0.LVDS_5_P
EXT0.LVDS_6_N: J9.21 ; port EXT0.LVDS_6_N
EXT0.LVDS_6_P: J9.20 ; port EXT0.LVDS_6_P
EXT0.LVDS_7_N: J9.24 ; port EXT0.LVDS_7_N
EXT0.LVDS_7_P: J9.23 ; port EXT0.LVDS_7_P
EXT1.LVDS_0_N: J10.3 ; port EXT1.LVDS_0_N
EXT1.LVDS_0_P: J10.2 ; port EXT1.LVDS_0_P
EXT1.LVDS_1_N: J10.6 ; port EXT1.LVDS_1_N
EXT1.LVDS_1_P: J10.5 ; port EXT1.LVDS_1_P
EXT1.LVDS_2_N: J10.9 ; port EXT1.LVDS_2_N
EXT1.LVDS_2_P: J10.8 ; port EXT1.LVDS_2_P
EXT1.LVDS_3_N: J10.12 ; port EXT1.LVDS_3_N
EXT1.LVDS_3_P: J10.11 ; port EXT1.LVDS_3_P
EXT1.LVDS_4_N: J10.15 ; port EXT1.LVDS_4_N
EXT1.LVDS_4_P: J10.14 ; port EXT1.LVDS_4_P
EXT1.LVDS_5_N: J10.18 ; port EXT1.LVDS_5_N
EXT1.LVDS_5_P: J10.17 ; port EXT1.LVDS_5_P
EXT1.LVDS_6_N: J10.21 ; port EXT1.LVDS_6_N
EXT1.LVDS_6_P: J10.20 ; port EXT1.LVDS_6_P
EXT1.LVDS_7_N: J10.24 ; port EXT1.LVDS_7_N
EXT1.LVDS_7_P: J10.23 ; port EXT1.LVDS_7_P
EXT2.LVDS_0_N: J11.3 ; port EXT2.LVDS_0_N
EXT2.LVDS_0_P: J11.2 ; port EXT2.LVDS_0_P
EXT2.LVDS_1_N: J11.6 ; port EXT2.LVDS_1_N
EXT2.LVDS_1_P: J11.5 ; port EXT2.LVDS_1_P
EXT2.LVDS_2_N: J11.9 ; port EXT2.LVDS_2_N
EXT2.LVDS_2_P: J11.8 ; port EXT2.LVDS_2_P
EXT2.LVDS_3_N: J11.12 ; port EXT2.LVDS_3_N
EXT2.LVDS_3_P: J11.11 ; port EXT2.LVDS_3_P
EXT2.LVDS_4_N: J11.15 ; port EXT2.LVDS_4_N
EXT2.LVDS_4_P: J11.14 ; port EXT2.LVDS_4_P
EXT2.LVDS_5_N: J11.18 ; port EXT2.LVDS_5_N
EXT2.LVDS_5_P: J11.17 ; port EXT2.LVDS_5_P
EXT2.LVDS_6_N: J11.21 ; port EXT2.LVDS_6_N
EXT2.LVDS_6_P: J11.20 ; port EXT2.LVDS_6_P
EXT2.LVDS_7_N: J11.24 ; port EXT2.LVDS_7_N
EXT2.LVDS_7_P: J11.23 ; port EXT2.LVDS_7_P
EXT3.LVDS_0_N: J12.3 ; port EXT3.LVDS_0_N
EXT3.LVDS_0_P: J12.2 ; port EXT3.LVDS_0_P
EXT3.LVDS_1_N: J12.6 ; port EXT3.LVDS_1_N
EXT3.LVDS_1_P: J12.5 ; port EXT3.LVDS_1_P
EXT3.LVDS_2_N: J12.9 ; port EXT3.LVDS_2_N
EXT3.LVDS_2_P: J12.8 ; port EXT3.LVDS_2_P
EXT3.LVDS_3_N: J12.12 ; port EXT3.LVDS_3_N
EXT3.LVDS_3_P: J12.11 ; port EXT3.LVDS_3_P
EXT3.LVDS_4_N: J12.15 ; port EXT3.LVDS_4_N
EXT3.LVDS_4_P: J12.14 ; port EXT3.LVDS_4_P
EXT3.LVDS_5_N: J12.18 ; port EXT3.LVDS_5_N
EXT3.LVDS_5_P: J12.17 ; port EXT3.LVDS_5_P
EXT3.LVDS_6_N: J12.21 ; port EXT3.LVDS_6_N
EXT3.LVDS_6_P: J12.20 ; port EXT3.LVDS_6_P
EXT3.LVDS_7_N: J12.24 ; port EXT3.LVDS_7_N
EXT3.LVDS_7_P: J12.23 ; port EXT3.LVDS_7_P
EXT4.LVDS_0_N: J13.3 ; port EXT4.LVDS_0_N
EXT4.LVDS_0_P: J13.2 ; port EXT4.LVDS_0_P
EXT4.LVDS_1_N: J13.6 ; port EXT4.LVDS_1_N
EXT4.LVDS_1_P: J13.5 ; port EXT4.LVDS_1_P
EXT4.LVDS_2_N: J13.9 ; port EXT4.LVDS_2_N
EXT4.LVDS_2_P: J13.8 ; port EXT4.LVDS_2_P
EXT4.LVDS_3_N: J13.12 ; port EXT4.LVDS_3_N
EXT4.LVDS_3_P: J13.11 ; port EXT4.LVDS_3_P
EXT4.LVDS_4_N: J13.15 ; port EXT4.LVDS_4_N
EXT4.LVDS_4_P: J13.14 ; port EXT4.LVDS_4_P
EXT4.LVDS_5_N: J13.18 ; port EXT4.LVDS_5_N
EXT4.LVDS_5_P: J13.17 ; port EXT4.LVDS_5_P
EXT4.LVDS_6_N: J13.21 ; port EXT4.LVDS_6_N
EXT4.LVDS_6_P: J13.20 ; port EXT4.LVDS_6_P
EXT4.LVDS_7_N: J13.24 ; port EXT4.LVDS_7_N
EXT4.LVDS_7_P: J13.23 ; port EXT4.LVDS_7_P
EXT5.LVDS_0_N: J14.3 ; port EXT5.LVDS_0_N
EXT5.LVDS_0_P: J14.2 ; port EXT5.LVDS_0_P
EXT5.LVDS_1_N: J14.6 ; port EXT5.LVDS_1_N
EXT5.LVDS_1_P: J14.5 ; port EXT5.LVDS_1_P
EXT5.LVDS_2_N: J14.9 ; port EXT5.LVDS_2_N
EXT5.LVDS_2_P: J14.8 ; port EXT5.LVDS_2_P
EXT5.LVDS_3_N: J14.12 ; port EXT5.LVDS_3_N
EXT5.LVDS_3_P: J14.11 ; port EXT5.LVDS_3_P
EXT5.LVDS_4_N: J14.15 ; port EXT5.LVDS_4_N
EXT5.LVDS_4_P: J14.14 ; port EXT5.LVDS_4_P
EXT5.LVDS_5_N: J14.18 ; port EXT5.LVDS_5_N
EXT5.LVDS_5_P: J14.17 ; port EXT5.LVDS_5_P
EXT5.LVDS_6_N: J14.21 ; port EXT5.LVDS_6_N
EXT5.LVDS_6_P: J14.20 ; port EXT5.LVDS_6_P
EXT5.LVDS_7_N: J14.24 ; port EXT5.LVDS_7_N
EXT5.LVDS_7_P: J14.23 ; port EXT5.LVDS_7_P
EXT6.LVDS_0_N: J15.3 ; port EXT6.LVDS_0_N
EXT6.LVDS_0_P: J15.2 ; port EXT6.LVDS_0_P
EXT6.LVDS_1_N: J15.6 ; port EXT6.LVDS_1_N
EXT6.LVDS_1_P: J15.5 ; port EXT6.LVDS_1_P
EXT6.LVDS_2_N: J15.9 ; port EXT6.LVDS_2_N
EXT6.LVDS_2_P: J15.8 ; port EXT6.LVDS_2_P
EXT6.LVDS_3_N: J15.12 ; port EXT6.LVDS_3_N
EXT6.LVDS_3_P: J15.11 ; port EXT6.LVDS_3_P
EXT6.LVDS_4_N: J15.15 ; port EXT6.LVDS_4_N
EXT6.LVDS_4_P: J15.14 ; port EXT6.LVDS_4_P
EXT6.LVDS_5_N: J15.18 ; port EXT6.LVDS_5_N
EXT6.LVDS_5_P: J15.17 ; port EXT6.LVDS_5_P
EXT6.LVDS_6_N: J15.21 ; port EXT6.LVDS_6_N
EXT6.LVDS_6_P: J15.20 ; port EXT6.LVDS_6_P
EXT6.LVDS_7_N: J15.24 ; port EXT6.LVDS_7_N
EXT6.LVDS_7_P: J15.23 ; port EXT6.LVDS_7_P
EXT7.LVDS_0_N: J16.3 ; port EXT7.LVDS_0_N
EXT7.LVDS_0_P: J16.2 ; port EXT7.LVDS_0_P
EXT7.LVDS_1_N: J16.6 ; port EXT7.LVDS_1_N
EXT7.LVDS_1_P: J16.5 ; port EXT7.LVDS_1_P
EXT7.LVDS_2_N: J16.9 ; port EXT7.LVDS_2_N
EXT7.LVDS_2_P: J16.8 ; port EXT7.LVDS_2_P
EXT7.LVDS_3_N: J16.12 ; port EXT7.LVDS_3_N
EXT7.LVDS_3_P: J16.11 ; port EXT7.LVDS_3_P
EXT7.LVDS_4_N: J16.15 ; port EXT7.LVDS_4_N
EXT7.LVDS_4_P: J16.14 ; port EXT7.LVDS_4_P
EXT7.LVDS_5_N: J16.18 ; port EXT7.LVDS_5_N
EXT7.LVDS_5_P: J16.17 ; port EXT7.LVDS_5_P
EXT7.LVDS_6_N: J16.21 ; port EXT7.LVDS_6_N
EXT7.LVDS_6_P: J16.20 ; port EXT7.LVDS_6_P
EXT7.LVDS_7_N: J16.24 ; port EXT7.LVDS_7_N
EXT7.LVDS_7_P: J16.23 ; port EXT7.LVDS_7_P
EXT8.LVDS_0_N: J5.3 ; port EXT8.LVDS_0_N
EXT8.LVDS_0_P: J5.2 ; port EXT8.LVDS_0_P
EXT8.LVDS_1_N: J5.6 ; port EXT8.LVDS_1_N
EXT8.LVDS_1_P: J5.5 ; port EXT8.LVDS_1_P
EXT8.LVDS_2_N: J5.9 ; port EXT8.LVDS_2_N
EXT8.LVDS_2_P: J5.8 ; port EXT8.LVDS_2_P
EXT8.LVDS_3_N: J5.12 ; port EXT8.LVDS_3_N
EXT8.LVDS_3_P: J5.11 ; port EXT8.LVDS_3_P
EXT8.LVDS_4_N: J5.15 ; port EXT8.LVDS_4_N
EXT8.LVDS_4_P: J5.14 ; port EXT8.LVDS_4_P
EXT8.LVDS_5_N: J5.18 ; port EXT8.LVDS_5_N
EXT8.LVDS_5_P: J5.17 ; port EXT8.LVDS_5_P
EXT8.LVDS_6_N: J5.21 ; port EXT8.LVDS_6_N
EXT8.LVDS_6_P: J5.20 ; port EXT8.LVDS_6_P
EXT8.LVDS_7_N: J5.24 ; port EXT8.LVDS_7_N
EXT8.LVDS_7_P: J5.23 ; port EXT8.LVDS_7_P
EXT9.LVDS_0_N: J6.3 ; port EXT9.LVDS_0_N
EXT9.LVDS_0_P: J6.2 ; port EXT9.LVDS_0_P
EXT9.LVDS_1_N: J6.6 ; port EXT9.LVDS_1_N
EXT9.LVDS_1_P: J6.5 ; port EXT9.LVDS_1_P
EXT9.LVDS_2_N: J6.9 ; port EXT9.LVDS_2_N
EXT9.LVDS_2_P: J6.8 ; port EXT9.LVDS_2_P
EXT9.LVDS_3_N: J6.12 ; port EXT9.LVDS_3_N
EXT9.LVDS_3_P: J6.11 ; port EXT9.LVDS_3_P
EXT9.LVDS_4_N: J6.15 ; port EXT9.LVDS_4_N
EXT9.LVDS_4_P: J6.14 ; port EXT9.LVDS_4_P
EXT9.LVDS_5_N: J6.18 ; port EXT9.LVDS_5_N
EXT9.LVDS_5_P: J6.17 ; port EXT9.LVDS_5_P
EXT9.LVDS_6_N: J6.21 ; port EXT9.LVDS_6_N
EXT9.LVDS_6_P: J6.20 ; port EXT9.LVDS_6_P
EXT9.LVDS_7_N: J6.24 ; port EXT9.LVDS_7_N
EXT9.LVDS_7_P: J6.23 ; port EXT9.LVDS_7_P
EXT10.LVDS_0_N: J7.3 ; port EXT10.LVDS_0_N
EXT10.LVDS_0_P: J7.2 ; port EXT10.LVDS_0_P
EXT10.LVDS_1_N: J7.6 ; port EXT10.LVDS_1_N
EXT10.LVDS_1_P: J7.5 ; port EXT10.LVDS_1_P
EXT10.LVDS_2_N: J7.9 ; port EXT10.LVDS_2_N
EXT10.LVDS_2_P: J7.8 ; port EXT10.LVDS_2_P
EXT10.LVDS_3_N: J7.12 ; port EXT10.LVDS_3_N
EXT10.LVDS_3_P: J7.11 ; port EXT10.LVDS_3_P
EXT10.LVDS_4_N: J7.15 ; port EXT10.LVDS_4_N
EXT10.LVDS_4_P: J7.14 ; port EXT10.LVDS_4_P
EXT10.LVDS_5_N: J7.18 ; port EXT10.LVDS_5_N
EXT10.LVDS_5_P: J7.17 ; port EXT10.LVDS_5_P
EXT10.LVDS_6_N: J7.21 ; port EXT10.LVDS_6_N
EXT10.LVDS_6_P: J7.20 ; port EXT10.LVDS_6_P
EXT10.LVDS_7_N: J7.24 ; port EXT10.LVDS_7_N
EXT10.LVDS_7_P: J7.23 ; port EXT10.LVDS_7_P
EXT11.LVDS_0_N: J17.3 ; port EXT11.LVDS_0_N
EXT11.LVDS_0_P: J17.2 ; port EXT11.LVDS_0_P
EXT11.LVDS_1_N: J17.6 ; port EXT11.LVDS_1_N
EXT11.LVDS_1_P: J17.5 ; port EXT11.LVDS_1_P
EXT11.LVDS_2_N: J17.9 ; port EXT11.LVDS_2_N
EXT11.LVDS_2_P: J17.8 ; port EXT11.LVDS_2_P
EXT11.LVDS_3_N: J17.12 ; port EXT11.LVDS_3_N
EXT11.LVDS_3_P: J17.11 ; port EXT11.LVDS_3_P
EXT11.LVDS_4_N: J17.15 ; port EXT11.LVDS_4_N
EXT11.LVDS_4_P: J17.14 ; port EXT11.LVDS_4_P
EXT11.LVDS_5_N: J17.18 ; port EXT11.LVDS_5_N
EXT11.LVDS_5_P: J17.17 ; port EXT11.LVDS_5_P
EXT11.LVDS_6_N: J17.21 ; port EXT11.LVDS_6_N
EXT11.LVDS_6_P: J17.20 ; port EXT11.LVDS_6_P
EXT11.LVDS_7_N: J17.24 ; port EXT11.LVDS_7_N
EXT11.LVDS_7_P: J17.23 ; port EXT11.LVDS_7_P
I2C_SCL_0: D3.3(I/O2) J9.27
I2C_SCL_1: D4.3(I/O2) J10.27
I2C_SCL_2: D5.3(I/O2) J11.27
I2C_SCL_3: D6.3(I/O2) J12.27
I2C_SCL_4: D7.3(I/O2) J13.27
I2C_SCL_5: D8.3(I/O2) J14.27
I2C_SCL_6: D9.3(I/O2) J15.27
I2C_SCL_7: D10.3(I/O2) J16.27
I2C_SCL_8: D11.3(I/O2) J5.27
I2C_SCL_9: D13.3(I/O2) J6.27
I2C_SCL_10: D12.3(I/O2) J7.27
I2C_SCL_11: D14.3(I/O2) J17.27
I2C_SDA_0: D3.2(I/O1) J9.26
I2C_SDA_1: D4.2(I/O1) J10.26
I2C_SDA_2: D5.2(I/O1) J11.26
I2C_SDA_3: D6.2(I/O1) J12.26
I2C_SDA_4: D7.2(I/O1) J13.26
I2C_SDA_5: D8.2(I/O1) J14.26
I2C_SDA_6: D9.2(I/O1) J15.26
I2C_SDA_7: D10.2(I/O1) J16.26
I2C_SDA_8: D11.2(I/O1) J5.26
I2C_SDA_9: D13.2(I/O1) J6.26
I2C_SDA_10: D12.2(I/O1) J7.26
I2C_SDA_11: D14.2(I/O1) J17.26

### Buses and harness runs
bus I2C_SCL_[11..0] = port I2C_SCL_[11..0]
bus I2C_SDA_[11..0] = port I2C_SDA_[11..0]
harness EXT0 = port EXT0
harness EXT1 = port EXT1
harness EXT2 = port EXT2
harness EXT3 = port EXT3

### Layout directives
net class D100: EXT0.LVDS_0_N, EXT0.LVDS_0_P, EXT0.LVDS_1_N, EXT0.LVDS_1_P, EXT0.LVDS_2_N, EXT0.LVDS_2_P, EXT0.LVDS_3_N, EXT0.LVDS_3_P, EXT0.LVDS_4_N, EXT0.LVDS_4_P, EXT0.LVDS_5_N, EXT0.LVDS_5_P, EXT0.LVDS_6_N, EXT0.LVDS_6_P, EXT0.LVDS_7_N, EXT0.LVDS_7_P, EXT1.LVDS_0_N, EXT1.LVDS_0_P, EXT1.LVDS_1_N, EXT1.LVDS_1_P, EXT1.LVDS_2_N, EXT1.LVDS_2_P, EXT1.LVDS_3_N, EXT1.LVDS_3_P, EXT1.LVDS_4_N, EXT1.LVDS_4_P, EXT1.LVDS_5_N, EXT1.LVDS_5_P, EXT1.LVDS_6_N, EXT1.LVDS_6_P, EXT1.LVDS_7_N, EXT1.LVDS_7_P, EXT2.LVDS_0_N, EXT2.LVDS_0_P, EXT2.LVDS_1_N, EXT2.LVDS_1_P, EXT2.LVDS_2_N, EXT2.LVDS_2_P, EXT2.LVDS_3_N, EXT2.LVDS_3_P, EXT2.LVDS_4_N, EXT2.LVDS_4_P, EXT2.LVDS_5_N, EXT2.LVDS_5_P, EXT2.LVDS_6_N, EXT2.LVDS_6_P, EXT2.LVDS_7_N, EXT2.LVDS_7_P, EXT3.LVDS_0_N, EXT3.LVDS_0_P, EXT3.LVDS_1_N, EXT3.LVDS_1_P, EXT3.LVDS_2_N, EXT3.LVDS_2_P, EXT3.LVDS_3_N, EXT3.LVDS_3_P, EXT3.LVDS_4_N, EXT3.LVDS_4_P, EXT3.LVDS_5_N, EXT3.LVDS_5_P, EXT3.LVDS_6_N, EXT3.LVDS_6_P, EXT3.LVDS_7_N, EXT3.LVDS_7_P, EXT4.LVDS_0_N, EXT4.LVDS_0_P, EXT4.LVDS_1_N, EXT4.LVDS_1_P, EXT4.LVDS_2_N, EXT4.LVDS_2_P, EXT4.LVDS_3_N, EXT4.LVDS_3_P, EXT4.LVDS_4_N, EXT4.LVDS_4_P, EXT4.LVDS_5_N, EXT4.LVDS_5_P, EXT4.LVDS_6_N, EXT4.LVDS_6_P, EXT4.LVDS_7_N, EXT4.LVDS_7_P, EXT5.LVDS_0_N, EXT5.LVDS_0_P, EXT5.LVDS_1_N, EXT5.LVDS_1_P, EXT5.LVDS_2_N, EXT5.LVDS_2_P, EXT5.LVDS_3_N, EXT5.LVDS_3_P, EXT5.LVDS_4_N, EXT5.LVDS_4_P, EXT5.LVDS_5_N, EXT5.LVDS_5_P, EXT5.LVDS_6_N, EXT5.LVDS_6_P, EXT5.LVDS_7_N, EXT5.LVDS_7_P, EXT6.LVDS_0_N, EXT6.LVDS_0_P, EXT6.LVDS_1_N, EXT6.LVDS_1_P, EXT6.LVDS_2_N, EXT6.LVDS_2_P, EXT6.LVDS_3_N, EXT6.LVDS_3_P, EXT6.LVDS_4_N, EXT6.LVDS_4_P, EXT6.LVDS_5_N, EXT6.LVDS_5_P, EXT6.LVDS_6_N, EXT6.LVDS_6_P, EXT6.LVDS_7_N, EXT6.LVDS_7_P, EXT7.LVDS_0_N, EXT7.LVDS_0_P, EXT7.LVDS_1_N, EXT7.LVDS_1_P, EXT7.LVDS_2_N, EXT7.LVDS_2_P, EXT7.LVDS_3_N, EXT7.LVDS_3_P, EXT7.LVDS_4_N, EXT7.LVDS_4_P, EXT7.LVDS_5_N, EXT7.LVDS_5_P, EXT7.LVDS_6_N, EXT7.LVDS_6_P, EXT7.LVDS_7_N, EXT7.LVDS_7_P, EXT8.LVDS_0_N, EXT8.LVDS_0_P, EXT8.LVDS_1_N, EXT8.LVDS_1_P, EXT8.LVDS_2_N, EXT8.LVDS_2_P, EXT8.LVDS_3_N, EXT8.LVDS_3_P, EXT8.LVDS_4_N, EXT8.LVDS_4_P, EXT8.LVDS_5_N, EXT8.LVDS_5_P, EXT8.LVDS_6_N, EXT8.LVDS_6_P, EXT8.LVDS_7_N, EXT8.LVDS_7_P, EXT9.LVDS_0_N, EXT9.LVDS_0_P, EXT9.LVDS_1_N, EXT9.LVDS_1_P, EXT9.LVDS_2_N, EXT9.LVDS_2_P, EXT9.LVDS_3_N, EXT9.LVDS_3_P, EXT9.LVDS_4_N, EXT9.LVDS_4_P, EXT9.LVDS_5_N, EXT9.LVDS_5_P, EXT9.LVDS_6_N, EXT9.LVDS_6_P, EXT9.LVDS_7_N, EXT9.LVDS_7_P, EXT10.LVDS_0_N, EXT10.LVDS_0_P, EXT10.LVDS_1_N, EXT10.LVDS_1_P, EXT10.LVDS_2_N, EXT10.LVDS_2_P, EXT10.LVDS_3_N, EXT10.LVDS_3_P, EXT10.LVDS_4_N, EXT10.LVDS_4_P, EXT10.LVDS_5_N, EXT10.LVDS_5_P, EXT10.LVDS_6_N, EXT10.LVDS_6_P, EXT10.LVDS_7_N, EXT10.LVDS_7_P, EXT11.LVDS_0_N, EXT11.LVDS_0_P, EXT11.LVDS_1_N, EXT11.LVDS_1_P, EXT11.LVDS_2_N, EXT11.LVDS_2_P, EXT11.LVDS_3_N, EXT11.LVDS_3_P, EXT11.LVDS_4_N, EXT11.LVDS_4_P, EXT11.LVDS_5_N, EXT11.LVDS_5_P, EXT11.LVDS_6_N, EXT11.LVDS_6_P, EXT11.LVDS_7_N, EXT11.LVDS_7_P
net class EXT0: EXT0.LVDS_0_N, EXT0.LVDS_0_P, EXT0.LVDS_1_N, EXT0.LVDS_1_P, EXT0.LVDS_2_N, EXT0.LVDS_2_P, EXT0.LVDS_3_N, EXT0.LVDS_3_P, EXT0.LVDS_4_N, EXT0.LVDS_4_P, EXT0.LVDS_5_N, EXT0.LVDS_5_P, EXT0.LVDS_6_N, EXT0.LVDS_6_P, EXT0.LVDS_7_N, EXT0.LVDS_7_P
net class EXT1: EXT1.LVDS_0_N, EXT1.LVDS_0_P, EXT1.LVDS_1_N, EXT1.LVDS_1_P, EXT1.LVDS_2_N, EXT1.LVDS_2_P, EXT1.LVDS_3_N, EXT1.LVDS_3_P, EXT1.LVDS_4_N, EXT1.LVDS_4_P, EXT1.LVDS_5_N, EXT1.LVDS_5_P, EXT1.LVDS_6_N, EXT1.LVDS_6_P, EXT1.LVDS_7_N, EXT1.LVDS_7_P
net class EXT2: EXT2.LVDS_0_N, EXT2.LVDS_0_P, EXT2.LVDS_1_N, EXT2.LVDS_1_P, EXT2.LVDS_2_N, EXT2.LVDS_2_P, EXT2.LVDS_3_N, EXT2.LVDS_3_P, EXT2.LVDS_4_N, EXT2.LVDS_4_P, EXT2.LVDS_5_N, EXT2.LVDS_5_P, EXT2.LVDS_6_N, EXT2.LVDS_6_P, EXT2.LVDS_7_N, EXT2.LVDS_7_P
net class EXT3: EXT3.LVDS_0_N, EXT3.LVDS_0_P, EXT3.LVDS_1_N, EXT3.LVDS_1_P, EXT3.LVDS_2_N, EXT3.LVDS_2_P, EXT3.LVDS_3_N, EXT3.LVDS_3_P, EXT3.LVDS_4_N, EXT3.LVDS_4_P, EXT3.LVDS_5_N, EXT3.LVDS_5_P, EXT3.LVDS_6_N, EXT3.LVDS_6_P, EXT3.LVDS_7_N, EXT3.LVDS_7_P
net class EXT7: EXT7.LVDS_0_N, EXT7.LVDS_0_P, EXT7.LVDS_1_N, EXT7.LVDS_1_P, EXT7.LVDS_2_N, EXT7.LVDS_2_P, EXT7.LVDS_3_N, EXT7.LVDS_3_P, EXT7.LVDS_4_N, EXT7.LVDS_4_P, EXT7.LVDS_5_N, EXT7.LVDS_5_P, EXT7.LVDS_6_N, EXT7.LVDS_6_P, EXT7.LVDS_7_N, EXT7.LVDS_7_P
net class EXT6: EXT6.LVDS_0_N, EXT6.LVDS_0_P, EXT6.LVDS_1_N, EXT6.LVDS_1_P, EXT6.LVDS_2_N, EXT6.LVDS_2_P, EXT6.LVDS_3_N, EXT6.LVDS_3_P, EXT6.LVDS_4_N, EXT6.LVDS_4_P, EXT6.LVDS_5_N, EXT6.LVDS_5_P, EXT6.LVDS_6_N, EXT6.LVDS_6_P, EXT6.LVDS_7_N, EXT6.LVDS_7_P
net class EXT5: EXT5.LVDS_0_N, EXT5.LVDS_0_P, EXT5.LVDS_1_N, EXT5.LVDS_1_P, EXT5.LVDS_2_N, EXT5.LVDS_2_P, EXT5.LVDS_3_N, EXT5.LVDS_3_P, EXT5.LVDS_4_N, EXT5.LVDS_4_P, EXT5.LVDS_5_N, EXT5.LVDS_5_P, EXT5.LVDS_6_N, EXT5.LVDS_6_P, EXT5.LVDS_7_N, EXT5.LVDS_7_P
net class EXT4: EXT4.LVDS_0_N, EXT4.LVDS_0_P, EXT4.LVDS_1_N, EXT4.LVDS_1_P, EXT4.LVDS_2_N, EXT4.LVDS_2_P, EXT4.LVDS_3_N, EXT4.LVDS_3_P, EXT4.LVDS_4_N, EXT4.LVDS_4_P, EXT4.LVDS_5_N, EXT4.LVDS_5_P, EXT4.LVDS_6_N, EXT4.LVDS_6_P, EXT4.LVDS_7_N, EXT4.LVDS_7_P
net class EXT11: EXT11.LVDS_0_N, EXT11.LVDS_0_P, EXT11.LVDS_1_N, EXT11.LVDS_1_P, EXT11.LVDS_2_N, EXT11.LVDS_2_P, EXT11.LVDS_3_N, EXT11.LVDS_3_P, EXT11.LVDS_4_N, EXT11.LVDS_4_P, EXT11.LVDS_5_N, EXT11.LVDS_5_P, EXT11.LVDS_6_N, EXT11.LVDS_6_P, EXT11.LVDS_7_N, EXT11.LVDS_7_P
net class EXT10: EXT10.LVDS_0_N, EXT10.LVDS_0_P, EXT10.LVDS_1_N, EXT10.LVDS_1_P, EXT10.LVDS_2_N, EXT10.LVDS_2_P, EXT10.LVDS_3_N, EXT10.LVDS_3_P, EXT10.LVDS_4_N, EXT10.LVDS_4_P, EXT10.LVDS_5_N, EXT10.LVDS_5_P, EXT10.LVDS_6_N, EXT10.LVDS_6_P, EXT10.LVDS_7_N, EXT10.LVDS_7_P
net class EXT9: EXT9.LVDS_0_N, EXT9.LVDS_0_P, EXT9.LVDS_1_N, EXT9.LVDS_1_P, EXT9.LVDS_2_N, EXT9.LVDS_2_P, EXT9.LVDS_3_N, EXT9.LVDS_3_P, EXT9.LVDS_4_N, EXT9.LVDS_4_P, EXT9.LVDS_5_N, EXT9.LVDS_5_P, EXT9.LVDS_6_N, EXT9.LVDS_6_P, EXT9.LVDS_7_N, EXT9.LVDS_7_P
net class EXT8: EXT8.LVDS_0_N, EXT8.LVDS_0_P, EXT8.LVDS_1_N, EXT8.LVDS_1_P, EXT8.LVDS_2_N, EXT8.LVDS_2_P, EXT8.LVDS_3_N, EXT8.LVDS_3_P, EXT8.LVDS_4_N, EXT8.LVDS_4_P, EXT8.LVDS_5_N, EXT8.LVDS_5_P, EXT8.LVDS_6_N, EXT8.LVDS_6_P, EXT8.LVDS_7_N, EXT8.LVDS_7_P

### Notes on the sheet
- Do not hotplug EEM modules!
- Project/Equipment
- Document
- Designer
- Drawn by
- Check.by
- Copyright WUT ISE 2020.
  This documentation describes Open Hardware and is licensed under the CERN OHL v.1.2. You may redistribute and modify this documentation under the terms of the CERN OHL v.1.2. (http://ohwr.org/CERNOHL). This documentation is distributed WITHOUT ANY EXPRESS OR IMPLIED WARRANTY, INCLUDING OF MERCHANTABILITY, SATISFACTORY QUALITY AND FITNESS FOR A PARTICULAR PURPOSE. Please see the CERN OHL v.1.2 for applicable conditions.
- Contact
- File
- Last Mod.
- Print Date
- Sheet
- Size
- A3
- of
- Rev

### Library data of the parts
C30-C37 C39-C42 = CC0201_100NF_6.3V_10%_X5R: Non-polarised capacitor; Part Description: SMD Multilayer Chip Ceramic Capacitor; Manufacturer: GENERIC; Manufacturer1 Part Number: 02016D104KAT2A; Voltage: 6.3V; TC: X5R; Tolerance: ±10%; Part Number: CC0201_100NF_6.3V_10%_X5R; Component Kind: Standard; Component Type: Standard; Pin Count: 2; Value: 100nF; Status: Not Recommended; Manufacturer Part Number: CC0201_100NF_6.3V_10%_X5R; Case: 0201; Mounted: Yes; Socket: No; SMD: Yes; Sense: No; Manufacturer1 Example: AVX; Manufacturer1 ComponentHeight: 0.33mm; HelpURL: \\cern.ch\dfs\Applications\Altium\Datasheets\CC0201_X5R_AVX.pdf; Author: CERN DEM JLC; CreateDate: 2007-12-03; LatestRevisionDate: 2007-12-03
D3-D14 = PRTR5V0U2X: Ultra Low Capacitance Double Rail-to-Rail ESD Protection Diode; Part Description: Ultra Low Capacitance (1pF) Double Rail-to-Rail ESD Protection Diode (8kV); Manufacturer: NXP SEMICONDUCTORS; Voltage: 5.5V; PressFit: No; Bonding: No; Part Number: PRTR5V0U2X; Component Kind: Standard; Component Type: Standard; Device: PRTR5V0U2X; PackageDescription: SOT143B, SOT, 1.90mm Pitch; 4 Pin, 1.30mm W X 2.90mm L X 1.10mm H body, IPC Medium Density; Manufacturer Part Number: PRTR5V0U2X; Pin Count: 4; Case: SOT143B; Mounted: Yes; Socket: No; SMD: Yes; Sense: No; ComponentHeight: 1.1mm; HelpURL: \\cern.ch\dfs\Applications\Altium\Datasheets\PRTR5V0U2X.pdf; Author: CERN DEM JLC; CreateDate: 22.03.2011; LatestRevisionDate: 22.03.2011
J5-J7 J9-J17 = 3M_N2530-6002RB: Connector 30 Male; Part Description: 30 Contacts - Straight .100'' x .100'' Low Profile Four-Wall Header, 2500 Series; Manufacturer: 3M; PressFit: No; Part Number: 3M_N2530-6002RB; Component Kind: Standard; Component Type: Standard; Pin Count: 30; Family: Header 30; Mounted: Yes; Socket: No; SMD: No; Sense: No; Status: None; Manufacturer Part Number: N2530-6002RB; ComponentHeight: 10.03mm; HelpURL: \\cern.ch\dfs\Applications\Altium\Datasheets\3M_N2530-6002RB.pdf; Author: CERN DEM JLC; CreateDate: 11.02.2009; LatestRevisionDate: 11.08.2009